# EAGLE design AudioMega Oliver v101 (EAGLE 6.3)
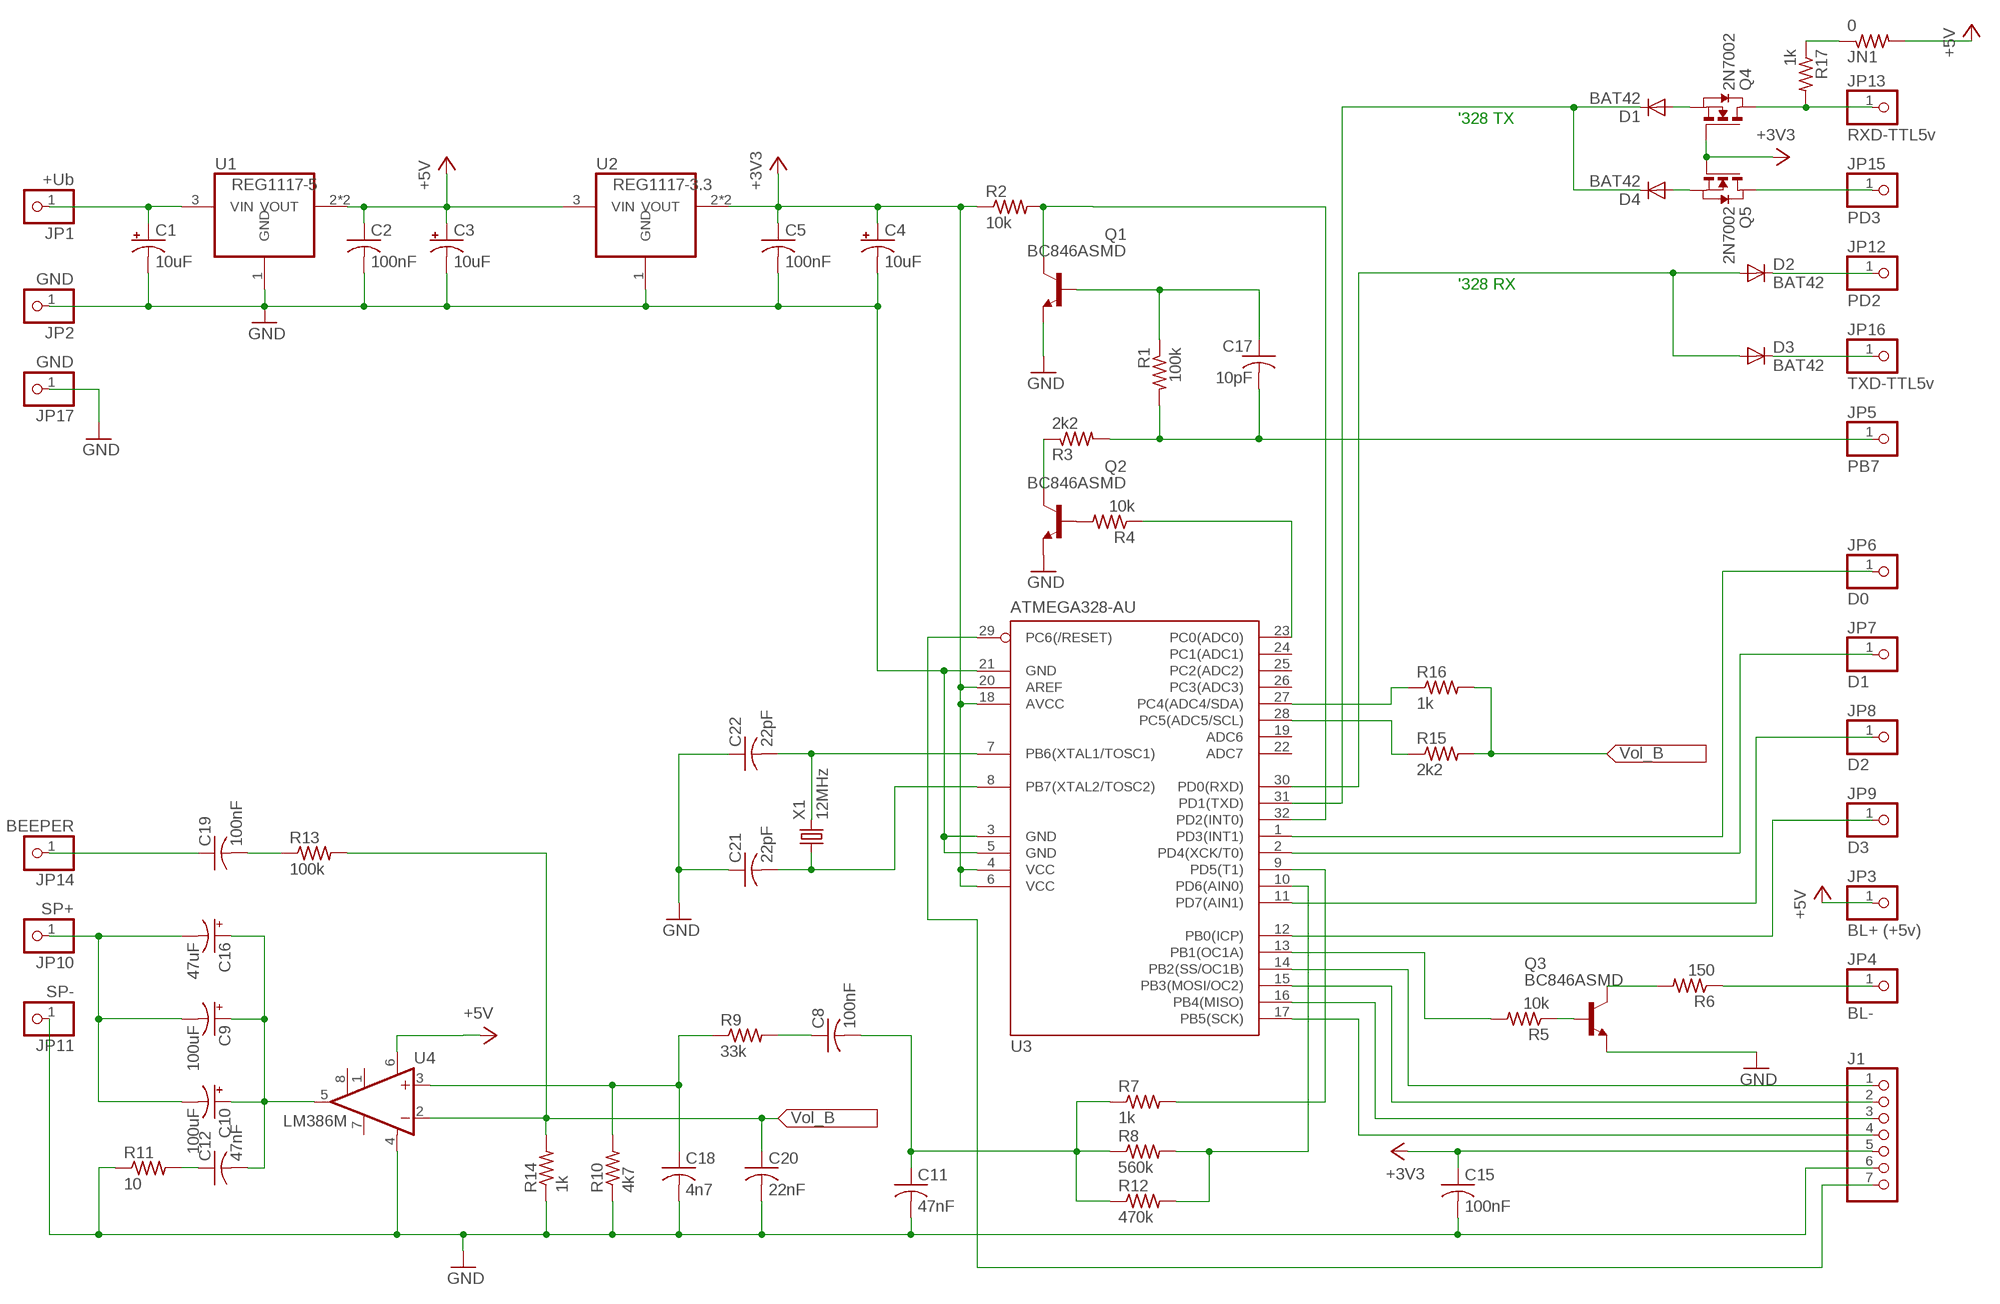
[diagram p0: schematic, sheet 1]

## Parts
C1  10uF  CPOL-USCT3528  [CT3528]
C2  100nF  C-USC1206  [C1206]
C3  10uF  CPOL-USCT3528  [CT3528]
C4  10uF  CPOL-USCT3528  [CT3528]
C5  100nF  C-USC1206  [C1206]
C8  100nF  C-USC1206  [C1206]
C9  100uF  CPOL-USCT6032  [CT6032]
C10  100uF  CPOL-USCT6032  [CT6032]
C11  47nF  C-USC1206  [C1206]
C12  47nF  C-USC1206  [C1206]
C15  100nF  C-USC1206  [C1206]
C16  47uF  CPOL-USCT6032  [CT6032]
C17  10pF  C-USC1206  [C1206]
C18  4n7  C-USC1206  [C1206]
C19  100nF  C-USC1206  [C1206]
C20  22nF  C-USC1206  [C1206]
C21  22pF  C-USC1206  [C1206]
C22  22pF  C-USC1206  [C1206]
D1  BAT42  DIODE-SOD123  [SOD123]
D2  BAT42  DIODE-SOD123  [SOD123]
D3  BAT42  DIODE-SOD123  [SOD123]
D4  BAT42  DIODE-SOD123  [SOD123]
J1  PINHD-1X7  [1X07]
JN1  0  R-US_R1206  [R1206]
JP1  +Ub  PINHD-1X1  [1X01]
JP2  GND  PINHD-1X1  [1X01]
JP3  BL+ (+5v)  PINHD-1X1  [1X01]
JP4  BL-  PINHD-1X1  [1X01]
JP5  PB7  PINHD-1X1  [1X01]
JP6  D0  PINHD-1X1  [1X01]
JP7  D1  PINHD-1X1  [1X01]
JP8  D2  PINHD-1X1  [1X01]
JP9  D3  PINHD-1X1  [1X01]
JP10  SP+  PINHD-1X1  [1X01]
JP11  SP-  PINHD-1X1  [1X01]
JP12  PD2  PINHD-1X1  [1X01]
JP13  RXD-TTL5v  PINHD-1X1  [1X01]
JP14  BEEPER  PINHD-1X1  [1X01]
JP15  PD3  PINHD-1X1  [1X01]
JP16  TXD-TTL5v  PINHD-1X1  [1X01]
JP17  GND  PINHD-1X1  [1X01]
Q1  BC846ASMD  [SOT23]
Q2  BC846ASMD  [SOT23]
Q3  BC846ASMD  [SOT23]
Q4  2N7002  NMOSSOT23  [SOT-23]
Q5  2N7002  NMOSSOT23  [SOT-23]
R1  100k  R-US_R1206  [R1206]
R2  10k  R-US_R1206  [R1206]
R3  2k2  R-US_R1206  [R1206]
R4  10k  R-US_R1206  [R1206]
R5  10k  R-US_R1206  [R1206]
R6  150  R-US_R1206  [R1206]
R7  1k  R-US_R1206  [R1206]
R8  560k  R-US_R1206  [R1206]
R9  33k  R-US_R1206  [R1206]
R10  4k7  R-US_R1206  [R1206]
R11  10  R-US_R1206  [R1206]
R12  470k  R-US_R1206  [R1206]
R13  100k  R-US_R1206  [R1206]
R14  1k  R-US_R1206  [R1206]
R15  2k2  R-US_R1206  [R1206]
R16  1k  R-US_R1206  [R1206]
R17  1k  R-US_R1206  [R1206]
U1  REG1117-5  REG1117  [SOT223]
U2  REG1117-3.3  REG1117  [SOT223]
U3  ATMEGA328-AU  MEGA8-AI  [TQFP32-08]
U4  LM386M  LM386M-1  [SO08]
X1  12MHz  CRYSTALHC49UP  [HC49UP]

## Nets
+3V3: C4.+ C5.1 C15.1 J1.5 Q4.3(G) Q5.3(G) R2.1 U2.2(VOUT) U2.4(VOUT) U3.4(VCC) U3.6(VCC) U3.18(AVCC) U3.20(AREF)
+5V: C2.1 C3.+ JN1.2 JP3.1 U1.2(VOUT) U1.4(VOUT) U2.3(VIN) U4.6(VS)
B7: C17.2 JP5.1 R1.2 R3.2
CLK: Q1.3(C) R2.2 U3.32(PD2(INT0))
GND: C1.- C2.2 C3.- C4.- C5.2 C11.2 C15.2 C18.2 C20.2 C21.1 C22.1 J1.6 JP2.1 JP11.1 JP17.1 Q1.2(E) Q2.2(E) Q3.2(E) R10.1 R11.1 R14.1 U1.1(GND) U2.1(GND) U3.3(GND) U3.5(GND) U3.21(GND) U4.4(GND)
N$1: R4.1 U3.23(PC0(ADC0))
N$2: D4.A Q5.2(S)
N$3: J1.2 U3.15(PB3(MOSI/OC2))
N$4: J1.3 U3.16(PB4(MISO))
N$5: J1.4 U3.17(PB5(SCK))
N$6: J1.7 U3.29(PC6(/RESET))
N$7: C22.2 U3.7(PB6(XTAL1/TOSC1)) X1.2
N$8: C21.2 U3.8(PB7(XTAL2/TOSC2)) X1.1
N$9: Q2.1(B) R4.2
N$10: R16.1 U3.27(PC4(ADC4/SDA))
N$11: R15.1 U3.28(PC5(ADC5/SCL))
N$12: Q2.3(C) R3.1
N$13: C17.1 Q1.1(B) R1.1
N$15: C9.- C10.- C16.- JP10.1
N$16: C12.1 R11.2
N$17: C9.+ C10.+ C12.2 C16.+ U4.5(OUT)
N$18: C18.1 R9.1 R10.2 U4.3(+IN)
N$19: C19.1 JP14.1
N$20: C19.2 R13.1
N$21: J1.1 U3.14(PB2(SS/OC1B))
N$22: JN1.1 R17.1
N$24: C8.1 R9.2
N$25: C8.2 C11.1 R7.1 R8.1 R12.1
N$26: Q3.3(C) R6.2
N$27: R7.2 U3.9(PD5(T1))
N$28: R8.2 R12.2 U3.10(PD6(AIN0))
N$29: JP4.1 R6.1
N$30: JP9.1 U3.12(PB0(ICP))
N$31: JP8.1 U3.11(PD7(AIN1))
N$32: C1.+ JP1.1 U1.3(VIN)
N$33: Q3.1(B) R5.1
N$34: R5.2 U3.13(PB1(OC1A))
N$35: JP7.1 U3.2(PD4(XCK/T0))
N$36: JP6.1 U3.1(PD3(INT1))
N$37: D3.C JP16.1
N$38: JP15.1 Q5.1(D)
N$39: D2.C JP12.1
N$41: JP13.1 Q4.1(D) R17.2
N$42: D2.A D3.A U3.30(PD0(RXD))
N$45: D1.A Q4.2(S)
N$46: D1.C D4.C U3.31(PD1(TXD))
VOL_B: C20.1 R13.2 R14.2 R15.2 R16.2 U4.2(-IN)
Unconnected: U3.19(ADC6) U3.22(ADC7) U3.24(PC1(ADC1)) U3.25(PC2(ADC2)) U3.26(PC3(ADC3)) U4.1(GAIN) U4.7(BYPASS) U4.8(GAIN)

## Notes on the sheet
- '328 TX
- '328 RX

## Library data of the parts
C1 C3 C4 C9 C10 C16 = resistor:CPOL-US: POLARIZED CAPACITOR, American symbol
C2 C5 C8 C11 C12 C15 C17-C22 = resistor:C-US: CAPACITOR, American symbol
D1-D4 = diode:DIODE-: DIODE
J1 = pinhead:PINHD-1X7: PIN HEADER
JN1 R1-R17 = resistor:R-US_: RESISTOR, American symbol
JP1-JP17 = pinhead:PINHD-1X1: PIN HEADER
Q1-Q3 = transistor-npn:BC846*: NPN Transistor
Q4 Q5 = zetex:NMOSSOT23: MOS FET; OC_FARNELL: unknown; OC_NEWARK: unknown
U1 U2 = burr-brown:REG1117: 800mA and 1A Low Dropout (LDO) Positive Regulator 1.8V, 2.5V, 2.85V, 3.3V, 5V, and Adj; MPN: REG1117; OC_FARNELL: 1097566; OC_NEWARK: 14P6981
U3 = atmel:MEGA8: MICROCONTROLLER 8 Kbytes FLASH, 1 kbytes SRAM, 512 bytes EEPROM, USART, 6-channel 10 bit ADC, 2-channel 8 bit ADC Pin compatible with Atmega48, ATMega88, ATMega168 Source: avr.lbr; MPN: ATMEGA8-16AU; OC_FARNELL: 9171371; OC_NEWARK: 73M8863
U4 = linear:LM386?-*: Low Voltage Audio Power Amplifier Source: http://cache.national.com/ds/LM/LM386.pdf
X1 = crystal:CRYSTAL: CRYSTAL; OC_FARNELL: unknown; OC_NEWARK: unknown

## Board
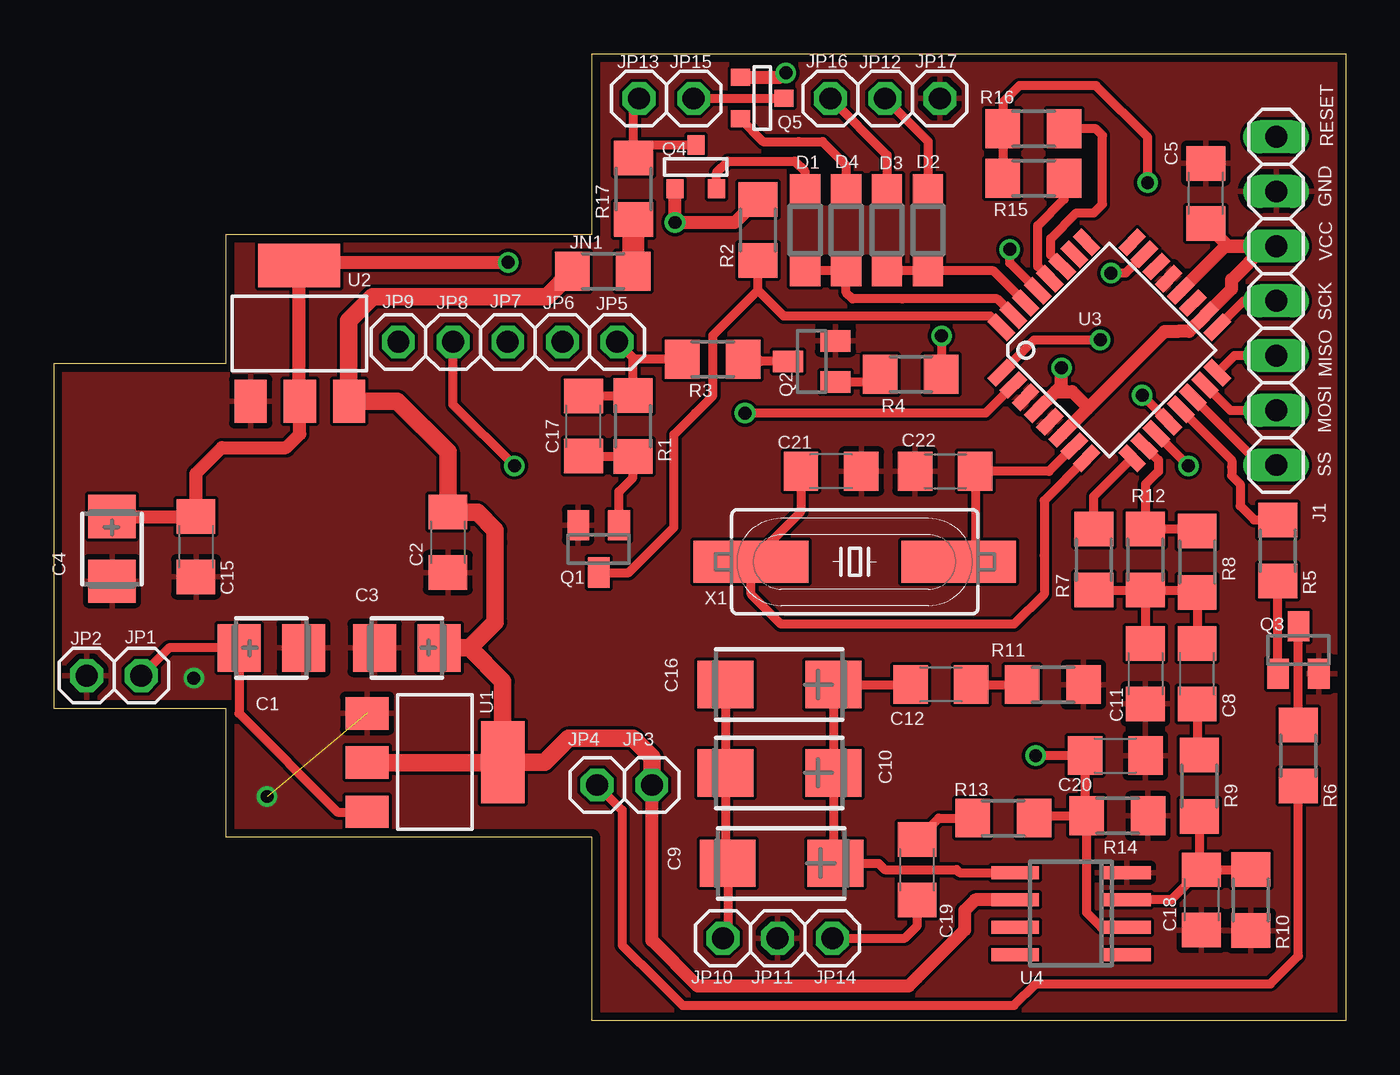
[diagram p1: board, top side]
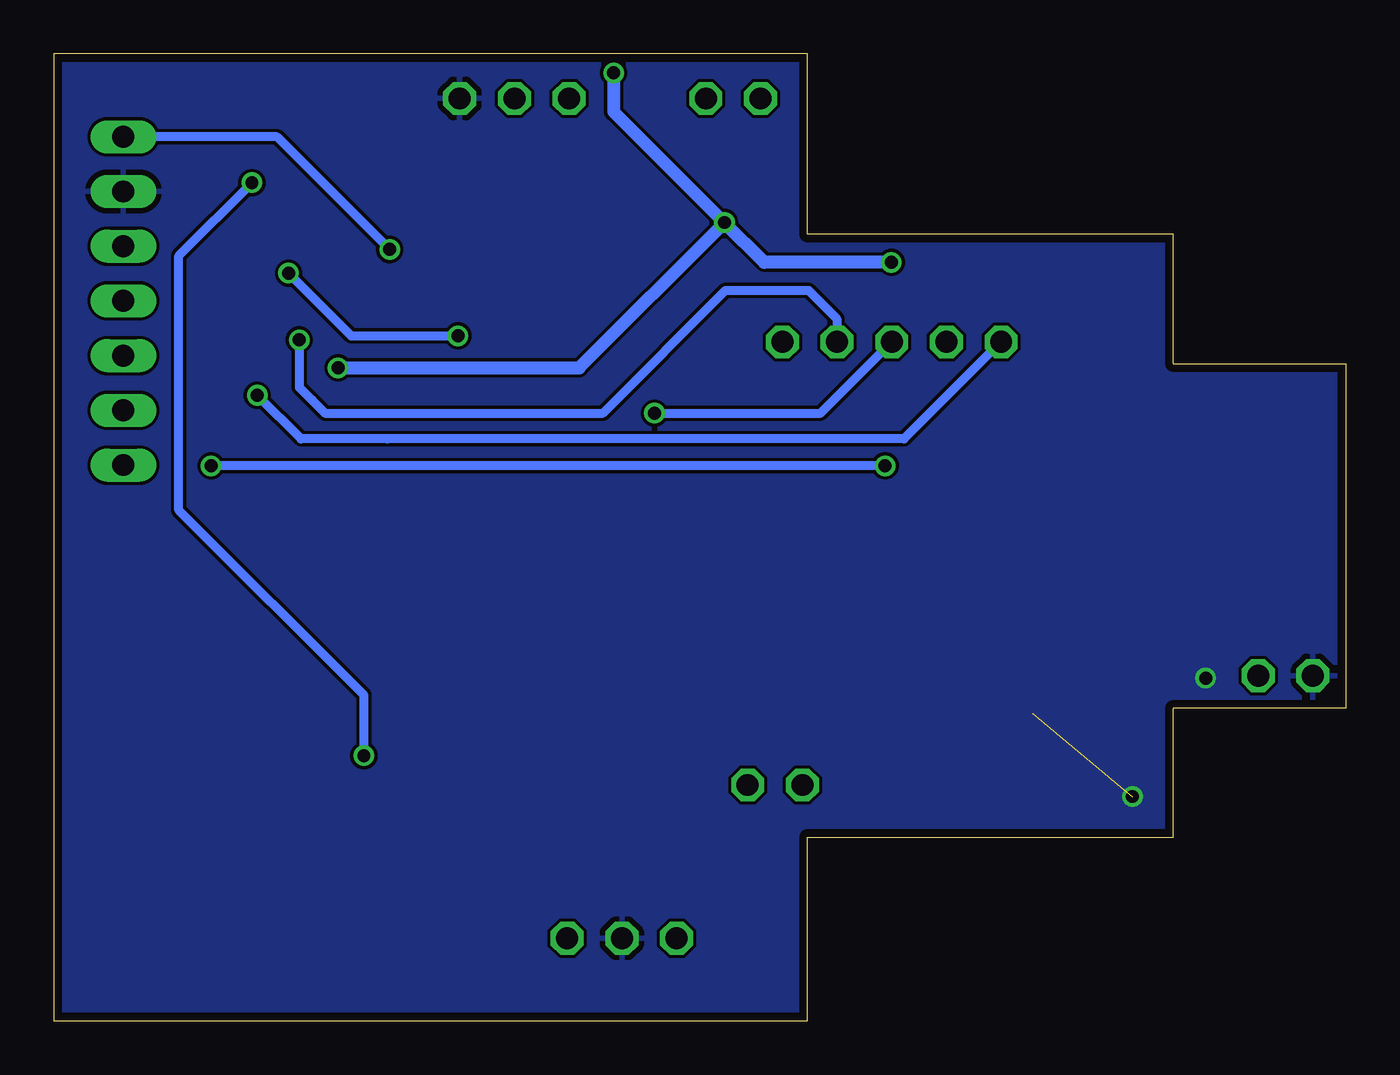
[diagram p2: board, bottom side, seen from below]

Size 60 x 44.89 mm. Coordinates in mm from the lower left corner, seen from the top.
Outline: 0,14.51 8,14.51 8,8.51 25,8.51 25,0 60,0 60,44.89 25,44.89 25,36.51 8,36.51 8,30.51 0,30.51 0,14.51
Copper layers (1*16): Top 0.0356mm / dielectric 1.5011mm / Bottom 0.0356mm
Design rules "LaenPCBOrder": minimum track width 6mil, minimum drill 13mil, track to track 6mil, track to pad 6mil, pad to pad 6mil, via to via 6mil, smd to smd 6mil, copper to edge 15mil, drill to drill 6mil, minimum pad ring 7mil, minimum via ring 7mil, stop-mask expansion 4mil, vias tented up to drill 0mil, thermal gap 10mil

### Footprints (pad centres in the part's own frame; a part is rotated, then mirrored left to right if it is on the bottom)
CT3528 = smd 2 x 2.2: + 1.5,0; - -1.5,0
C1206 = smd 1.6 x 1.8: 1 -1.4,0; 2 1.4,0
CT6032 = smd 2.6 x 2.2: + 2.5,0; - -2.5,0
SOD123 = smd 1.4 x 1.4: A 1.9,0; C -1.9,0
1X07 = drill 1.016 long: 1 -7.62,0; 2 -5.08,0; 3 -2.54,0; 4 0,0; 5 2.54,0; 6 5.08,0; 7 7.62,0
R1206 = smd 1.6 x 1.803: 1 -1.422,0; 2 1.422,0
1X01 = drill 1.016 octagon: 1 0,0
SOT23 = smd 1 x 1.4: 1 -0.95,-1.1; 2 0.95,-1.1; 3 0,1.1
SOT-23 = smd 0.787 x 0.889: 1 0.025,-1.016; 2 -0.94,1.016; 3 0.991,1.016
SOT223 = smd 1.499 x 2.007: 1 -2.261,-3.15; 2 0.025,-3.15; 3 2.311,-3.15 | smd 3.81 x 2.007: 4 0,3.15
TQFP32-08 = smd 1.27 x 0.559: 1 -4.293,2.8; 2 -4.293,2; 3 -4.293,1.2; 4 -4.293,0.4; 5 -4.293,-0.4; 6 -4.293,-1.2; 7 -4.293,-2; 8 -4.293,-2.8; 17 4.293,-2.8; 18 4.293,-2; 19 4.293,-1.2; 20 4.293,-0.4; 21 4.293,0.4; 22 4.293,1.2; 23 4.293,2; 24 4.293,2.8 | smd 0.559 x 1.27: 9 -2.8,-4.293; 10 -2,-4.293; 11 -1.2,-4.293; 12 -0.4,-4.293; 13 0.4,-4.293; 14 1.2,-4.293; 15 2,-4.293; 16 2.8,-4.293; 25 2.8,4.293; 26 2,4.293; 27 1.2,4.293; 28 0.4,4.293; 29 -0.4,4.293; 30 -1.2,4.293; 31 -2,4.293; 32 -2.8,4.293
SO08 = smd 0.6 x 2.2: 1 -1.905,-2.6; 2 -0.635,-2.6; 3 0.635,-2.6; 4 1.905,-2.6; 5 1.905,2.6; 6 0.635,2.6; 7 -0.635,2.6; 8 -1.905,2.6
HC49UP = smd 5.334 x 1.93: 1 -4.826,0; 2 4.826,0

### Placement (x,y rotation side)
C1  10.1,17.31 180 top
C2  18.3,22.21 270 top
C3  16.4,17.31 0 top
C4  2.7,21.91 90 top
C5  53.5,38.41 90 top
C8  53.1,16.11 90 top
C9  33.8,7.31 0 top
C10  33.7,11.51 0 top
C11  50.7,16.11 270 top
C12  41.2,15.61 180 top
C15  6.6,22.01 270 top
C16  33.7,15.61 0 top
C17  24.6,27.61 90 top
C18  53.3,5.61 270 top
C19  40.1,7.01 90 top
C20  49.3,12.31 0 top
C21  36.1,25.51 180 top
C22  41.4,25.51 0 top
D1  34.9,36.71 90 top
D2  40.6,36.71 270 top
D3  38.7,36.71 270 top
D4  36.8,36.71 90 top
J1  56.77,33.42 90 top
JN1  25.5,34.8 180 top
JP1  4.06,16.02 0 top
JP2  1.52,16.02 0 top
JP3  27.77,10.94 0 top
JP4  25.23,10.94 0 top
JP5  26.16,31.51 0 top
JP6  23.62,31.51 0 top
JP7  21.08,31.51 0 top
JP8  18.54,31.51 0 top
JP9  16,31.51 0 top
JP10  31.08,3.83 0 top
JP11  33.62,3.83 0 top
JP12  38.61,42.82 0 top
JP13  27.18,42.82 0 top
JP14  36.16,3.83 0 top
JP15  29.72,42.82 0 top
JP16  36.07,42.82 0 top
JP17  41.15,42.82 0 top
Q1  25.3,21.91 180 top
Q2  35.2,30.61 90 top
Q3  57.8,17.21 0 top
Q4  29.84,39.64 180 top
Q5  32.9,42.81 90 top
R1  26.9,27.61 90 top
R2  32.7,36.71 270 top
R3  30.6,30.71 180 top
R4  39.8,30.01 180 top
R5  56.85,21.83 90 top
R6  57.8,12.31 90 top
R7  48.3,21.41 90 top
R8  53.1,21.31 90 top
R9  53.2,10.91 90 top
R10  55.6,5.61 90 top
R11  46.4,15.61 180 top
R12  50.7,21.41 90 top
R13  44.1,9.41 0 top
R14  49.4,9.51 180 top
R15  45.5,39.11 180 top
R16  45.5,41.41 180 top
R17  26.92,38.63 90 top
U1  17.7,12.01 270 top
U2  11.4,31.91 0 top
U3  49.02,31.13 45 top
U4  47.24,4.97 90 top
X1  37.2,21.31 0 top

### Tracks (layer width: path | path; a pad name or v marks a point on that pad's centre or on a via)
+3V3  (via drill 0.6)
  Top 0.61: C4.+ C15.1 6.6,25.41 7.8,26.61 10.79,26.61 11.42,27.24 U2.2 11.4,28.78 U2.4 11.55,35.21 v21.1,35.21 | J1.5 54.55,35.96 C5.1 | U3.20 54.41,35.96 J1.5 | J1.5 56.25,35.96 54.7,34.41 54.7,33.98 U3.18 52.73,32.01 52.2,32.01 51.59,32.01 48,28.41 | U3.6 48,28.41 | Q4.3 v28.85,37.06 31.63,37.06 R2.1 | Q5.3 33.69,43.8 v34,44.01 | 48,28.41 48,28.51 47.3,29.21 46.53,29.21 U3.4 46.8,29.48 v46.8,30.31
  Bottom 0.61: v21.1,35.21 27,35.21 v28.85,37.06 | v34,44.01 34,42.21 v28.85,37.06 | v46.8,30.31 35.6,30.31 v28.85,37.06
+5V
  Top 0.61: U4.6 42.8,5.61 42.3,5.11 42.3,4.21 40.1,2.01 39.7,1.61 29.9,1.61 27.77,3.73 JP3.1
  Top 0.813: U1.2 20.82,11.98 U1.4 | U1.4 20.85,15.76 19.3,17.31 | 19.3,17.31 C3.+ 19.3,17.31 | JP3.1 27.77,12.23 26.9,13.11 23.9,13.11 22.8,12.01 U1.4 | 19.3,17.31 20.2,18.21 20.5,18.51 20.5,22.21 20.5,22.77 19.67,23.6 C2.1 18.3,26.41 15.95,28.76 U2.3 13.7,28.77 13.7,32.51 14.81,33.62 22.9,33.62 JN1.2
B7
  Top 0.406: C17.2 26.88,29.01 R1.2 26.9,30.78 JP5.1 26.97,30.71 R3.2
CLK
  Top 0.406: U3.32 43.49,32.71 39.2,32.71 33.9,32.71 32.7,33.91 | 32.7,33.91 R2.2 | Q1.3 26.7,20.81 28.8,22.91 28.8,27.21 29.8,28.21 30.61,29.02 30.61,30.9 30.61,31.82 32.7,33.91
GND  (via drill 0.6)  (1 unrouted)
  other vias: 6.5,15.91 9.9,10.41
  pour Top: -0.1,0.01 60.1,0.01 60.1,45.01 -0.1,45.01
  pour Bottom: -0.1,0.01 60,0.01 60,45.01 -0.1,45.01
N$1  (via drill 0.6)
  Top 0.406: U3.23 49.77,34.71 v49.1,34.71 | v41.23,31.8 v41.22,31.79 R4.1
  Bottom 0.406: v49.1,34.71 46.19,31.8 v41.23,31.8
N$2
  Top 0.406: Q5.2 32.94,40.81 34.6,40.81 35.7,40.81 36.8,39.71 D4.A
N$3
  Top 0.406: U3.15 54.64,28.34 J1.2
N$4
  Top 0.406: J1.3 54.84,30.88 U3.16
N$5
  Top 0.406: J1.4 55.27,33.42 U3.17
N$6  (via drill 0.6)
  Top 0.406: U3.29 44.4,35.19 v44.4,35.81
  Bottom 0.406: v44.4,35.81 49.63,41.04 J1.7
N$7
  Top 0.406: U3.7 46.23,25.51 C22.2 42.8,22.08 X1.2
N$8
  Top 0.406: C21.2 34.7,23.63 X1.1 32.38,19.81 33.78,18.41 44.6,18.41 46,19.81 46,21.61 46,24.15 U3.8
N$9
  Top 0.406: Q2.1 38.03,29.66 R4.2
N$10
  Top 0.406: U3.27 46.3,35.55 46.3,36.31 47.5,37.51 47.8,37.51 48.3,37.51 48.7,37.91 48.7,41.11 48.4,41.41 R16.1
N$11
  Top 0.406: U3.28 45.7,35.02 45.7,36.91 46.92,38.13 R15.1
N$12
  Top 0.406: R3.1 32.23,31.21 32.83,30.61 Q2.3
N$13
  Top 0.406: C17.1 24.62,26.19 R1.1 26.9,25.21 26.25,24.56 Q1.1
N$15
  Top 0.406: C16.- C10.- 31.2,7.41 C9.- 31.3,4.05 JP10.1
N$16
  Top 0.406: C12.1 R11.2
N$17
  Top 0.406: U4.5 42.06,6.88 41.93,7.01 38.6,7.01 38.4,7.21 38.3,7.31 C9.+ 36.2,7.41 C10.+ C16.+ C12.2
N$18
  Top 0.406: C18.1 51.9,5.61 U4.3 | R9.1 53.2,7.11 C18.1 | C18.1 55.58,7.01 R10.2
N$19
  Top 0.406: JP14.1 39.52,3.83 40.1,4.41 C19.1
N$20
  Top 0.406: C19.2 41.1,9.41 R13.1
N$21
  Top 0.406: U3.14 56.05,25.8 J1.1
N$22
  Top 0.406: JN1.1
  Top 1.016: JN1.1 R17.1
N$24
  Top 0.406: C8.1 53.1,12.43 R9.2
N$25
  Top 0.406: R7.1 R12.1 | R12.1 53,19.99 R8.1 C8.2 | R12.1 C11.1
N$26
  Top 0.406: R6.2 Q3.3
N$27
  Top 0.406: R7.2 48.3,24.34 U3.9
N$28
  Top 0.406: R8.2 53,22.83 R12.2 50.7,24.91 51.3,25.51 51.3,26.03 U3.10
N$29
  Top 0.406: JP4.1 26.4,9.77 26.4,5.41 26.4,3.51 28.1,1.81 29.2,0.71 44.6,0.71 45.6,1.71 54,1.71 56.5,1.71 57.8,3.01 R6.1
N$30  (via drill 0.6)
  Top 0.406: U3.12 v50.55,29.04
  Bottom 0.406: JP9.1 20.51,27.01 44.5,27.01 48.52,27.01 v50.55,29.04
N$31  (via drill 0.6)
  Top 0.406: U3.11 v52.7,25.76 | v52.7,25.76 | JP8.1 18.54,28.67 18.54,28.61 v21.39,25.76
  Bottom 0.406: v21.39,25.76 21.45,25.76 v52.7,25.76
N$32
  Top 0.406: JP1.1 5.35,17.31 C1.+ 8.6,14.27 13.18,9.69 U1.3
N$33
  Top 0.406: Q3.1 R5.1
N$34
  Top 0.406: U3.13 54.7,26.02 54.7,25.71 54.7,25.31 55.1,24.91 55.1,23.9 55.75,23.25 R5.2
N$35  (via drill 0.6)
  Top 0.406: U3.2 43.27,28.21 v32.1,28.21
  Bottom 0.406: v32.1,28.21 24.39,28.21 JP7.1
N$36  (via drill 0.6)
  Top 0.406: U3.1 45.54,31.61 v48.6,31.61
  Bottom 0.406: v48.6,31.61 48.6,29.41 48,28.81 47.4,28.21 34.5,28.21 28.8,33.91 26.7,33.91 24.95,33.91 23.63,32.59 JP6.1
N$37
  Top 0.406: JP16.1 38.7,40.19 D3.C
N$38
  Top 0.406: JP15.1 29.73,42.83 Q5.1
N$39
  Top 0.406: JP12.1 40.6,40.83 D2.C
N$41
  Top 0.406: JP13.1 26.92,42.56 R17.2 27.53,40.66 Q4.1
N$42
  Top 0.406: D3.A D2.A 43.65,34.81 U3.30
N$45
  Top 0.406: D1.A 34.9,39.41 34.4,39.91 31.3,39.91 30.79,39.39 Q4.2
N$46
  Top 0.406: D1.C D4.C 36.8,33.81 37.1,33.51 39.4,33.51 43.82,33.51 U3.31
VOL_B  (via drill 0.6)
  Top 0.406: R13.2 45.62,9.51 R14.2 | R14.2 47.9,9.59 C20.1 v45.6,12.31 | U4.2 48.65,4.34 47.97,5.02 R14.2 | R15.2 R16.2 44.08,42.64 44.85,43.41 48.4,43.41 50.8,41.01 v50.8,38.91
  Bottom 0.406: v45.6,12.31 45.6,15.11 54.2,23.71 54.2,35.51 v50.8,38.91

### Text on the board
tNames: RESET | GND | VCC | SCK | MISO | MOSI | SS